# EAGLE schematic vga (EAGLE 9.6.2)
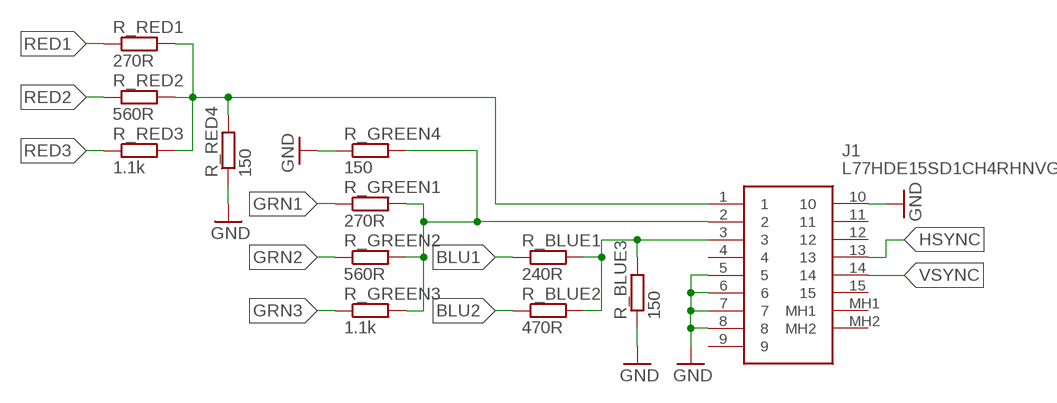
[diagram p0: schematic, sheet 1]

## Parts
J1  L77HDE15SD1CH4RHNVGA  [L77HDE15SD1CH4RHNVGA]
R_BLUE1  240R  R-EU_R0805  [R0805]
R_BLUE2  470R  R-EU_R0805  [R0805]
R_BLUE3  150  R-EU_R0805  [R0805]
R_GREEN1  270R  R-EU_R0805  [R0805]
R_GREEN2  560R  R-EU_R0805  [R0805]
R_GREEN3  1.1k  R-EU_R0805  [R0805]
R_GREEN4  150  R-EU_R0805  [R0805]
R_RED1  270R  R-EU_R0805  [R0805]
R_RED2  560R  R-EU_R0805  [R0805]
R_RED3  1.1k  R-EU_R0805  [R0805]
R_RED4  150  R-EU_R0805  [R0805]

## Nets
BLU1: R_BLUE1.1
BLU2: R_BLUE2.1
GND: J1.5 J1.6 J1.7 J1.8 J1.10 R_BLUE3.1 R_GREEN4.1 R_RED4.1
GRN1: R_GREEN1.1
GRN2: R_GREEN2.1
GRN3: R_GREEN3.1
HSYNC: J1.13
N$1: J1.2 R_GREEN1.2 R_GREEN2.2 R_GREEN3.2 R_GREEN4.2
N$3: J1.3 R_BLUE1.2 R_BLUE2.2 R_BLUE3.2
N$5: J1.1 R_RED1.2 R_RED2.2 R_RED3.2 R_RED4.2
RED1: R_RED1.1
RED2: R_RED2.1
RED3: R_RED3.1
VSYNC: J1.14
Unconnected: J1.4 J1.9 J1.11 J1.12 J1.15 J1.MH1 J1.MH2

## Library data of the parts
J1 = L77HDE15SD1CH4RHNVGA:L77HDE15SD1CH4RHNVGA: D-Sub High Density Connectors Dsub, Stamped Signal 3A, High Density, Right Angle PCB Thru Hole, FP=8.89mm (.350"), 15 Socket, Bright Tin Shell, Flash Gold, 4-40 Rear Insert, Ground Tab with Boardlock, High Temp, Nickel Shell, VGA Source: Datasheet <https://componentsearchengine.com/Datasheets/1/L77HDE15SD1CH4RHNVGA.pdf>; ARROW_PART_NUMBER: L77HDE15SD1CH4RHNVGA; ARROW_PRICE-STOCK: https://www.arrow.com/en/products/l77hde15sd1ch4rhnvga/amphenol-fci?region=nac; DESCRIPTION: D-Sub High Density Connectors Dsub, Stamped Signal 3A, High Density, Right Angle PCB Thru Hole, FP=8.89mm (.350"), 15 Socket, Bright Tin Shell, Flash Gold, 4-40 Rear Insert, Ground Tab with Boardlock, High Temp, Nickel Shell, VGA; HEIGHT: 12.55mm; MANUFACTURER_NAME: Amphenol; MANUFACTURER_PART_NUMBER: L77HDE15SD1CH4RHNVGA; MOUSER_PART_NUMBER: 523-7HDE15SDH4RHNVGA; MOUSER_PRICE-STOCK: https://www.mouser.co.uk/ProductDetail/Amphenol-Commercial-Products/L77HDE15SD1CH4RHNVGA?qs=f9yNj16SXrKPVxRw%2FcVQYg%3D%3D
R_BLUE1-R_BLUE3 R_GREEN1-R_GREEN4 R_RED1-R_RED4 = rcl:R-EU_: RESISTOR, European symbol; SPICEPREFIX: R